# Altium schematic sheet Repeat(ideal_diode,1 , 2).SchDoc
size A4; SheetNumber: 4; SheetTotal: 7
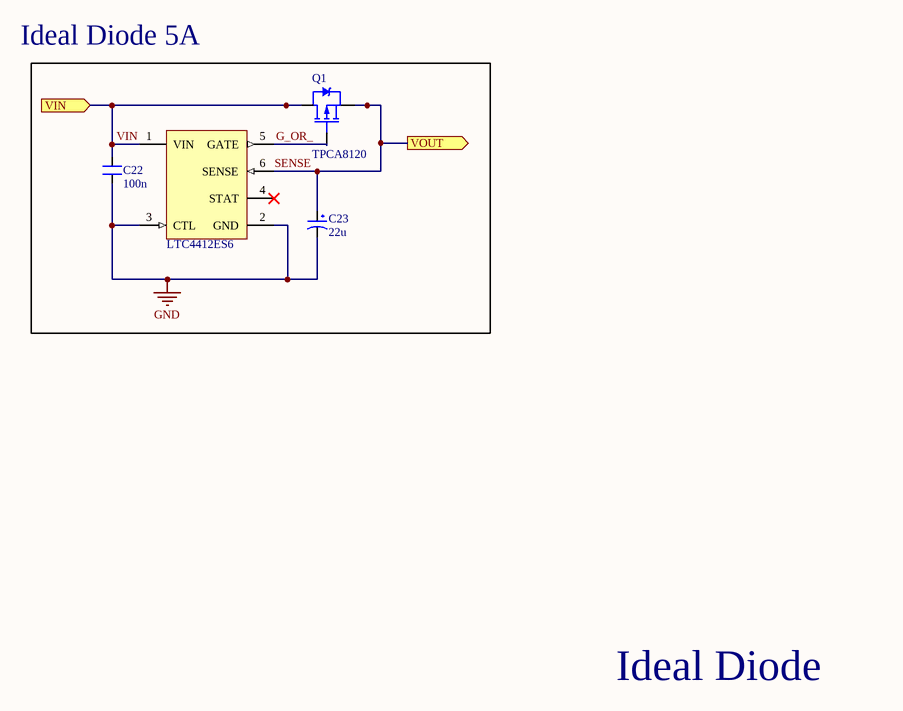
[diagram p0: Repeat(ideal_diode,1 , 2).SchDoc]

## Parts
C22  100n  [CN-SMD-0603]
C23  22u  [TANTALUM_SMD_1206]
Q1  TPCA8120  [TPCA8120]
U3  LTC4412ES6  [LT-S6-6-TSOT-23_L]

## Ports
VIN (in, see Electrical Power System[3B]), VOUT (out, see Electrical Power System[4B])

## Nets
GND: C22.1 C23.2 U3.2(GND) U3.3(CTL)
G_OR_: Q1.4(G) U3.5(GATE)
SENSE: C23.1 Q1.1,2,3(S) U3.6(SENSE) ; port VOUT
VIN: C22.2 Q1.5,6,7,8(D) U3.1(VIN) ; port VIN

Not connected (* = marked no-connect by the designer): U3 4(STAT)*

## Notes on the sheet
- Ideal Diode 5A
- Ideal Diode

## Library data of the parts
C22 = Capacitors: Value: 33pF
C23 = Cap_Tantalum SMD: SMD; Chung_Loai: Dán; Don_Vi: Con; So_Chan: 2; Ten_Linh_Kien: Tụ tantalum 477A-470uF 10V SMD7343; Ma_Hang: MH001956; Kieu_Chan: *
U3 = CMP-0479-00433-1: Low Loss PowerPath(TM) Controller, 2.5 to 28 V Vin, 6-pin SOT23 (S6-6), -40 to 85 degC; Manufacturer: Linear Technology; Ideal Diode: Single, External, P-Channel; PackageVersion: Jun-10; Code_JEDEC: MO-193; PackageReference: S6-6; ComponentLink2Description: Datasheet; Mounting Technology: Surface Mount; PackageDescription: 6-Pin Plastic TSOT-23, Body 2.9 x 1.63 mm, Pitch 0.95 mm; ComponentLink1URL: http://www.linear.com/; RoHS: FALSE; ComponentLink3Description: Package Specification; ComponentLink2URL: http://cds.linear.com/docs/en/datasheet/4412fa.pdf; ComponentLink1Description: Manufacturer URL; ComponentLink3URL: http://cds.linear.com/docs/en/packaging/SOT_6_05-08-1636.pdf; PartNumber: LTC4412ES6